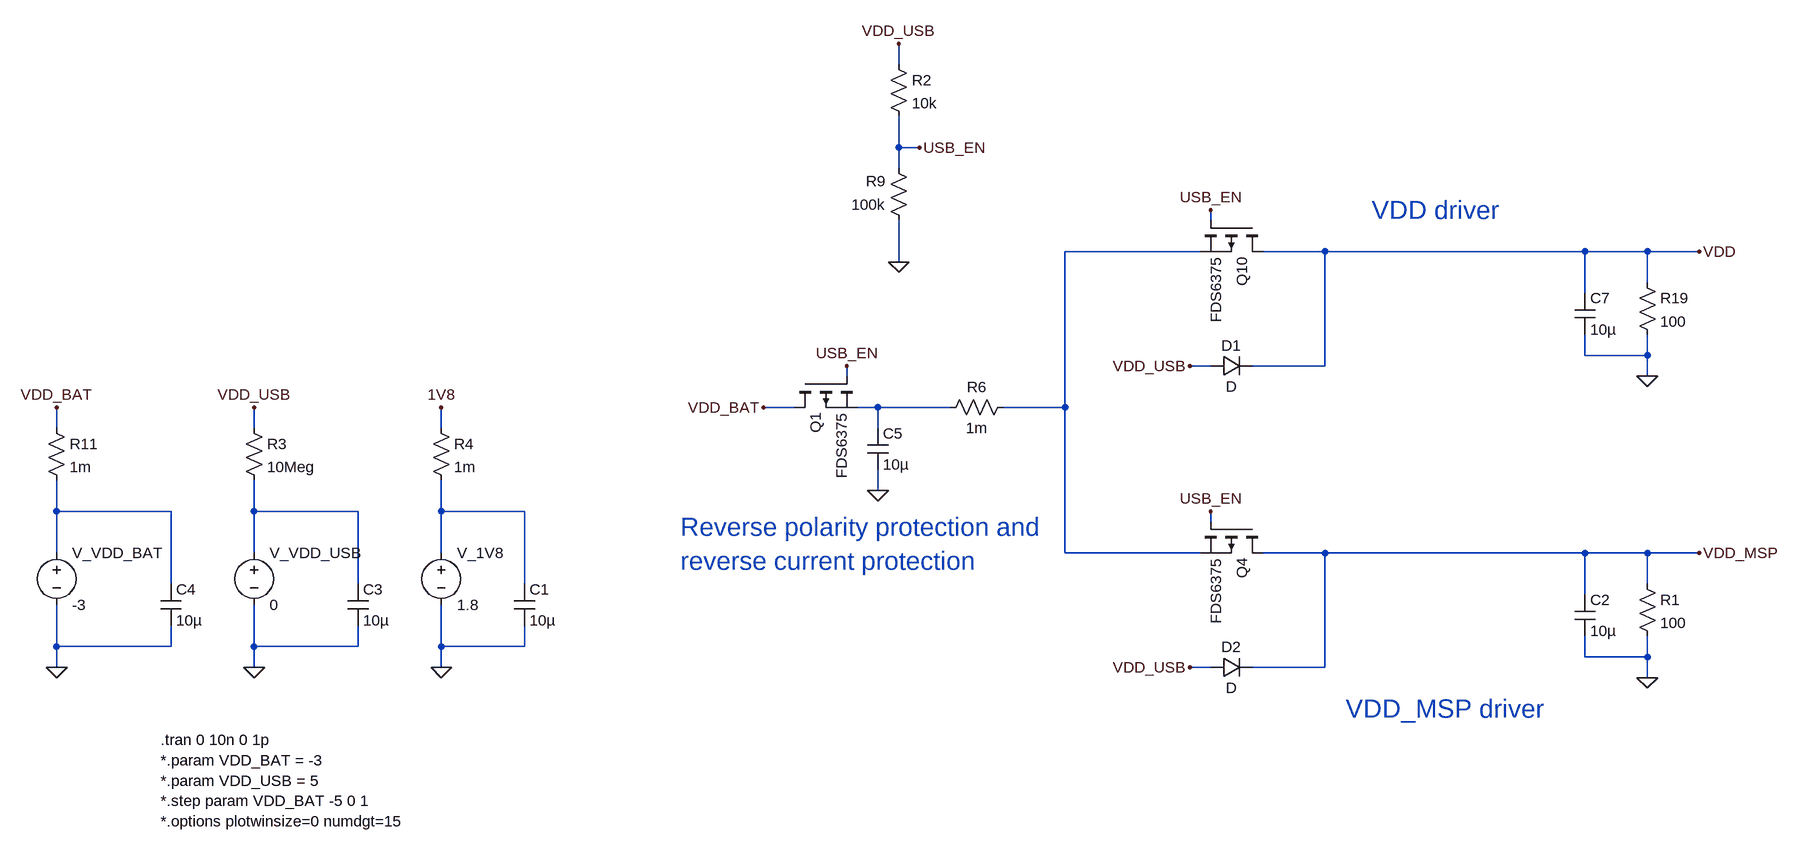
[diagram p0: schematic Schematic.asc]
Schematic.asc, the LTspice schematic file:
Version 4
SHEET 1 1688 680
WIRE -864 -1120 -864 -1152
WIRE -864 -992 -864 -1040
WIRE -832 -992 -864 -992
WIRE -864 -960 -864 -992
WIRE -384 -880 -384 -896
WIRE -400 -832 -608 -832
WIRE -208 -832 -304 -832
WIRE 192 -832 -208 -832
WIRE 288 -832 192 -832
WIRE 368 -832 288 -832
WIRE -864 -816 -864 -880
WIRE 288 -784 288 -832
WIRE 192 -768 192 -832
WIRE 192 -672 192 -704
WIRE 288 -672 288 -704
WIRE 288 -672 192 -672
WIRE -384 -656 -416 -656
WIRE -208 -656 -208 -832
WIRE -208 -656 -320 -656
WIRE -944 -640 -944 -656
WIRE 288 -640 288 -672
WIRE -1024 -592 -1072 -592
WIRE -896 -592 -928 -592
WIRE -784 -592 -896 -592
WIRE -608 -592 -608 -832
WIRE -608 -592 -704 -592
WIRE -2160 -560 -2160 -592
WIRE -1856 -560 -1856 -592
WIRE -1568 -560 -1568 -592
WIRE -896 -560 -896 -592
WIRE -896 -464 -896 -496
WIRE -2160 -432 -2160 -480
WIRE -1984 -432 -2160 -432
WIRE -1856 -432 -1856 -480
WIRE -1696 -432 -1856 -432
WIRE -1568 -432 -1568 -480
WIRE -1440 -432 -1568 -432
WIRE -384 -416 -384 -432
WIRE -2160 -368 -2160 -432
WIRE -1856 -368 -1856 -432
WIRE -1568 -368 -1568 -432
WIRE -608 -368 -608 -592
WIRE -400 -368 -608 -368
WIRE -208 -368 -304 -368
WIRE 192 -368 -208 -368
WIRE 288 -368 192 -368
WIRE 368 -368 288 -368
WIRE -1984 -320 -1984 -432
WIRE -1696 -320 -1696 -432
WIRE -1440 -320 -1440 -432
WIRE 288 -320 288 -368
WIRE 192 -304 192 -368
WIRE -2160 -224 -2160 -288
WIRE -1984 -224 -1984 -256
WIRE -1984 -224 -2160 -224
WIRE -1856 -224 -1856 -288
WIRE -1696 -224 -1696 -256
WIRE -1696 -224 -1856 -224
WIRE -1568 -224 -1568 -288
WIRE -1440 -224 -1440 -256
WIRE -1440 -224 -1568 -224
WIRE 192 -208 192 -240
WIRE 288 -208 288 -240
WIRE 288 -208 192 -208
WIRE -2160 -192 -2160 -224
WIRE -1856 -192 -1856 -224
WIRE -1568 -192 -1568 -224
WIRE -384 -192 -416 -192
WIRE -208 -192 -208 -368
WIRE -208 -192 -320 -192
WIRE 288 -176 288 -208
FLAG 368 -368 VDD_MSP
FLAG -1856 -192 0
FLAG -2160 -192 0
FLAG -1568 -192 0
FLAG 288 -176 0
FLAG -864 -1152 VDD_USB
FLAG -1856 -592 VDD_USB
FLAG -1568 -592 1V8
FLAG -1072 -592 VDD_BAT
FLAG -2160 -592 VDD_BAT
FLAG -896 -464 0
FLAG -864 -816 0
FLAG 368 -832 VDD
FLAG 288 -640 0
FLAG -832 -992 USB_EN
FLAG -384 -896 USB_EN
FLAG -944 -656 USB_EN
FLAG -384 -432 USB_EN
FLAG -416 -656 VDD_USB
FLAG -416 -192 VDD_USB
SYMBOL res 272 -336 R0
SYMATTR InstName R1
SYMATTR Value 100
SYMBOL res -880 -1136 R0
SYMATTR InstName R2
SYMATTR Value 10k
SYMBOL res -1872 -576 R0
SYMATTR InstName R3
SYMATTR Value 10Meg
SYMBOL cap 176 -304 R0
SYMATTR InstName C2
SYMATTR Value 10µ
SYMBOL cap -1456 -320 R0
SYMATTR InstName C1
SYMATTR Value 10µ
SYMBOL cap -1712 -320 R0
SYMATTR InstName C3
SYMATTR Value 10µ
SYMBOL cap -2000 -320 R0
SYMATTR InstName C4
SYMATTR Value 10µ
SYMBOL res -2176 -576 R0
SYMATTR InstName R11
SYMATTR Value 1m
SYMBOL voltage -2160 -384 R0
SYMATTR InstName V_VDD_BAT
SYMATTR Value -3
SYMATTR SpiceLine Cpar=1f
SYMBOL voltage -1856 -384 R0
SYMATTR InstName V_VDD_USB
SYMATTR Value 0
SYMBOL voltage -1568 -384 R0
SYMATTR InstName V_1V8
SYMATTR Value 1.8
SYMBOL res -1584 -576 R0
SYMATTR InstName R4
SYMATTR Value 1m
SYMBOL pmos -1024 -640 M90
SYMATTR InstName Q1
SYMATTR Value FDS6375
SYMBOL cap -912 -560 R0
SYMATTR InstName C5
SYMATTR Value 10µ
SYMBOL res -848 -864 R180
WINDOW 0 36 76 Left 2
WINDOW 3 36 40 Left 2
SYMATTR InstName R9
SYMATTR Value 100k
SYMBOL res 272 -800 R0
SYMATTR InstName R19
SYMATTR Value 100
SYMBOL cap 176 -768 R0
SYMATTR InstName C7
SYMATTR Value 10µ
SYMBOL pmos -304 -880 R90
SYMATTR InstName Q10
SYMATTR Value FDS6375
SYMBOL res -688 -608 R90
WINDOW 0 0 56 VBottom 2
WINDOW 3 32 56 VTop 2
SYMATTR InstName R6
SYMATTR Value 1m
SYMBOL pmos -304 -416 R90
SYMATTR InstName Q4
SYMATTR Value FDS6375
SYMBOL diode -384 -640 R270
WINDOW 0 32 32 VTop 2
WINDOW 3 0 32 VBottom 2
SYMATTR InstName D1
SYMBOL diode -384 -176 R270
WINDOW 0 32 32 VTop 2
WINDOW 3 0 32 VBottom 2
SYMATTR InstName D2
TEXT -2000 -80 Left 2 !.tran 0 10n 0 1p\n*.param VDD_BAT = -3\n*.param VDD_USB = 5\n*.step param VDD_BAT -5 0 1\n*.options plotwinsize=0 numdgt=15
TEXT -1200 -408 Left 4 ;Reverse polarity protection and\nreverse current protection
TEXT -136 -896 Left 4 ;VDD driver
TEXT -176 -128 Left 4 ;VDD_MSP driver

The netlist it stands for:
* Schematic.asc
R1 VDD_MSP 0 100
R2 VDD_USB USB_EN 10k
R3 VDD_USB N004 10Meg
C2 VDD_MSP 0 10µ
C1 N005 0 10µ
C3 N004 0 10µ
C4 N003 0 10µ
R11 VDD_BAT N003 1m
V_VDD_BAT N003 0 -3 Cpar=1f
V_VDD_USB N004 0 0
V_1V8 N005 0 1.8
R4 1V8 N005 1m
M§Q1 VDD_BAT USB_EN N002 N002 FDS6375
C5 N002 0 10µ
R9 0 USB_EN 100k
R19 VDD 0 100
C7 VDD 0 10µ
M§Q10 VDD USB_EN N001 N001 FDS6375
R6 N001 N002 1m
M§Q4 VDD_MSP USB_EN N001 N001 FDS6375
D1 VDD_USB VDD D
D2 VDD_USB VDD_MSP D
.model D D
.lib standard.dio
.model NMOS NMOS
.model PMOS PMOS
.lib standard.mos
.tran 0 10n 0 1p
*.param VDD_BAT = -3
*.param VDD_USB = 5
*.step param VDD_BAT -5 0 1
*.options plotwinsize=0 numdgt=15
* Reverse polarity protection and
* reverse current protection
* VDD driver
* VDD_MSP driver
.backanno
.end